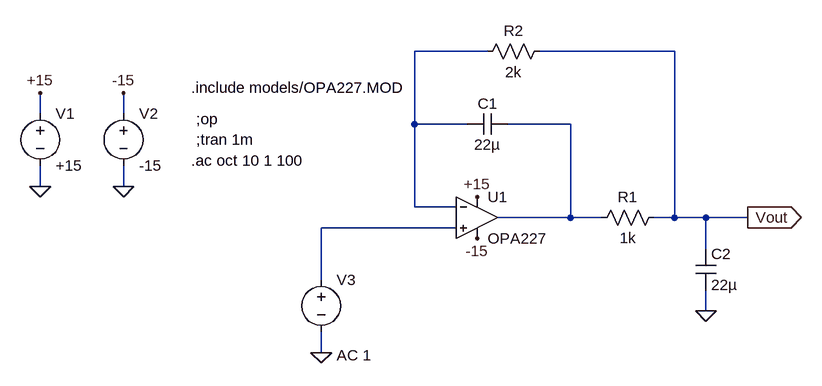
[diagram p0: schematic vref_filter.asc]
vref_filter.asc, the LTspice schematic file:
Version 4
SHEET 1 880 680
WIRE -272 -400 -384 -400
WIRE 16 -400 -192 -400
WIRE -960 -304 -960 -336
WIRE -832 -304 -832 -336
WIRE -384 -288 -384 -400
WIRE -304 -288 -384 -288
WIRE -144 -288 -240 -288
WIRE -960 -192 -960 -224
WIRE -832 -192 -832 -224
WIRE -384 -160 -384 -288
WIRE -320 -160 -384 -160
WIRE -144 -144 -144 -288
WIRE -144 -144 -256 -144
WIRE -96 -144 -144 -144
WIRE 16 -144 16 -400
WIRE 16 -144 -16 -144
WIRE 64 -144 16 -144
WIRE 128 -144 64 -144
WIRE -320 -128 -528 -128
WIRE 64 -96 64 -144
WIRE -528 -48 -528 -128
WIRE 64 0 64 -32
WIRE -528 64 -528 32
FLAG -960 -192 0
FLAG -832 -192 0
FLAG -960 -336 +15
FLAG -832 -336 -15
FLAG -288 -176 +15
FLAG -288 -112 -15
FLAG -528 64 0
FLAG 128 -144 Vout
IOPIN 128 -144 Out
FLAG 64 0 0
SYMBOL voltage -960 -320 R0
WINDOW 123 0 0 Left 0
WINDOW 39 0 0 Left 0
SYMATTR InstName V1
SYMATTR Value +15
SYMBOL voltage -832 -320 R0
WINDOW 123 0 0 Left 0
WINDOW 39 0 0 Left 0
SYMATTR InstName V2
SYMATTR Value -15
SYMBOL Opamps\\opamp2 -288 -208 R0
SYMATTR InstName U1
SYMATTR Value OPA227
SYMBOL res -112 -128 R270
WINDOW 0 32 56 VTop 0
WINDOW 3 0 56 VBottom 0
SYMATTR InstName R1
SYMATTR Value 1k
SYMBOL cap -304 -272 R270
WINDOW 0 32 32 VTop 0
WINDOW 3 0 32 VBottom 0
SYMATTR InstName C1
SYMATTR Value 22µ
SYMBOL res -288 -384 R270
WINDOW 0 32 56 VTop 0
WINDOW 3 0 56 VBottom 0
SYMATTR InstName R2
SYMATTR Value 2k
SYMBOL voltage -528 -64 R0
WINDOW 123 24 132 Left 0
WINDOW 39 0 0 Left 0
SYMATTR Value2 AC 1
SYMATTR InstName V3
SYMATTR Value ""
SYMBOL cap 48 -96 R0
SYMATTR InstName C2
SYMATTR Value 22µ
TEXT -728 -344 Left 0 !.include models/OPA227.MOD
TEXT -720 -296 Left 0 !;op
TEXT -720 -264 Left 0 !;tran 1m
TEXT -728 -232 Left 0 !.ac oct 10 1 100

The netlist it stands for:
* vref_filter.asc
V1 +15 0 +15
V2 -15 0 -15
XU1 N003 N001 +15 -15 N002 OPA227  ; pins In+ In- V+ V- OUT
R1 N002 Vout 1k
C1 N001 N002 22µ
R2 N001 Vout 2k
V3 N003 0 AC 1
C2 Vout 0 22µ
.include models/OPA227.MOD
;op
;tran 1m
.ac oct 10 1 100
.backanno
.end